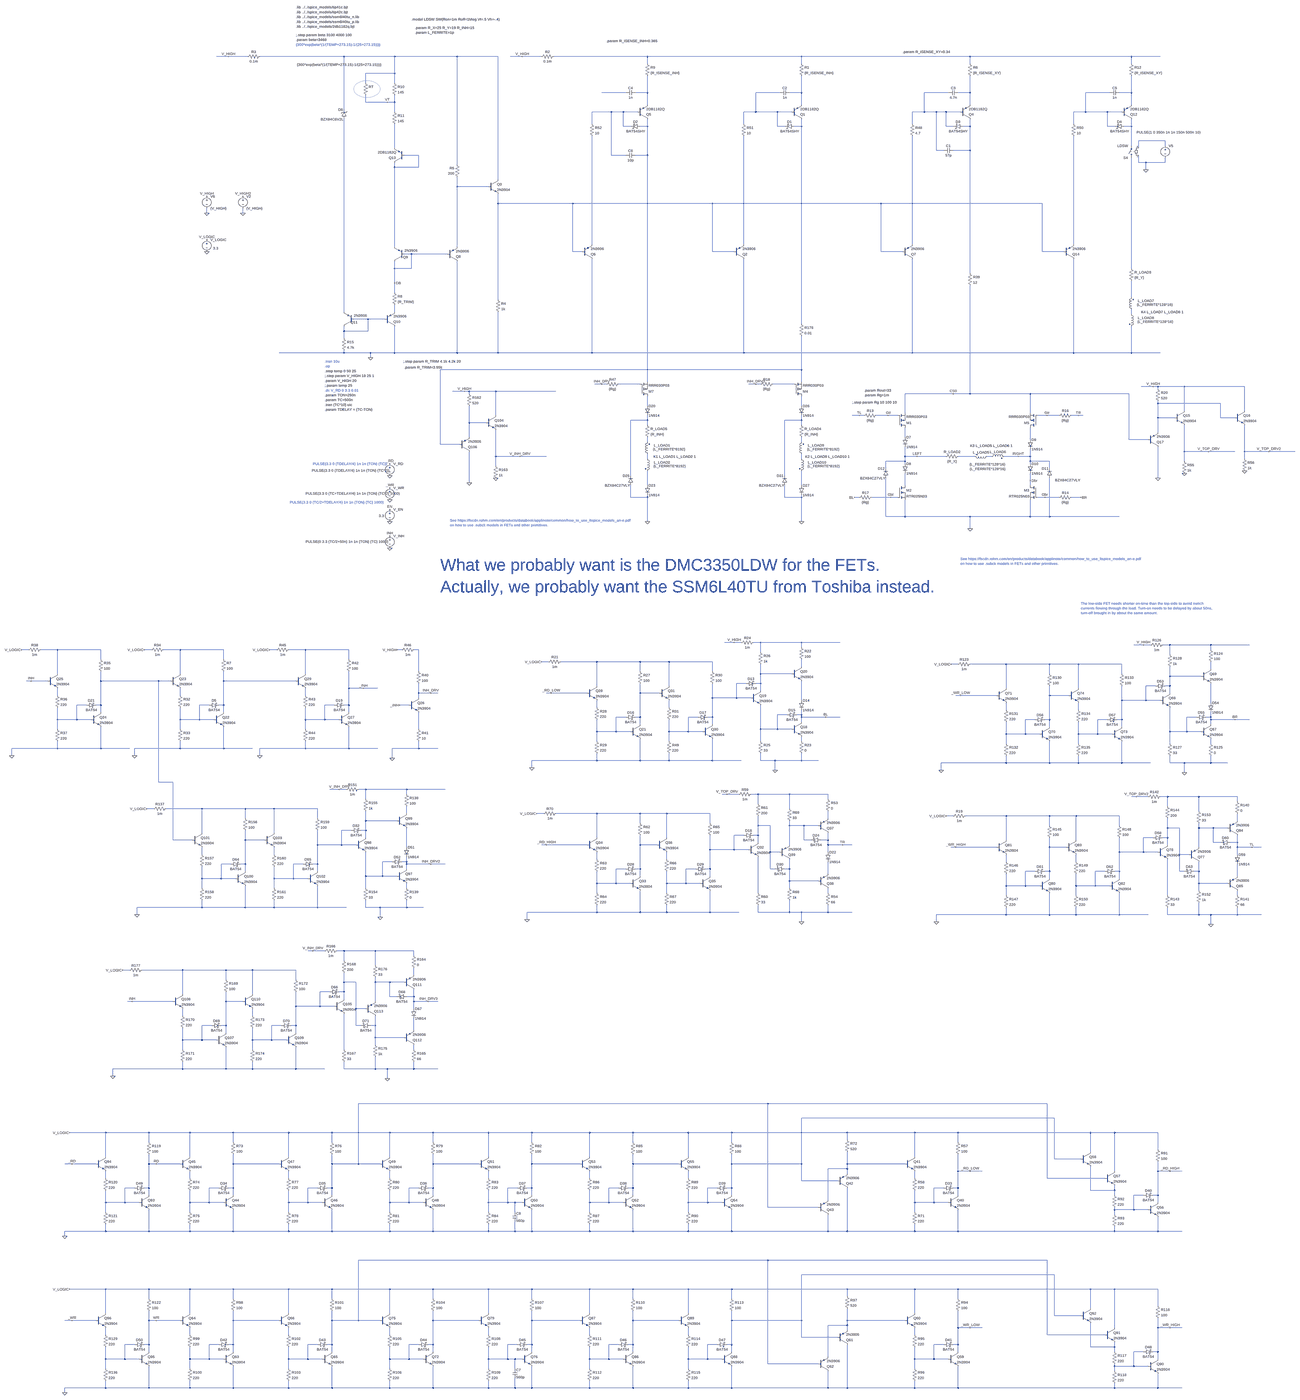
[diagram p0: schematic line_switch_new4.asc, whole sheet]
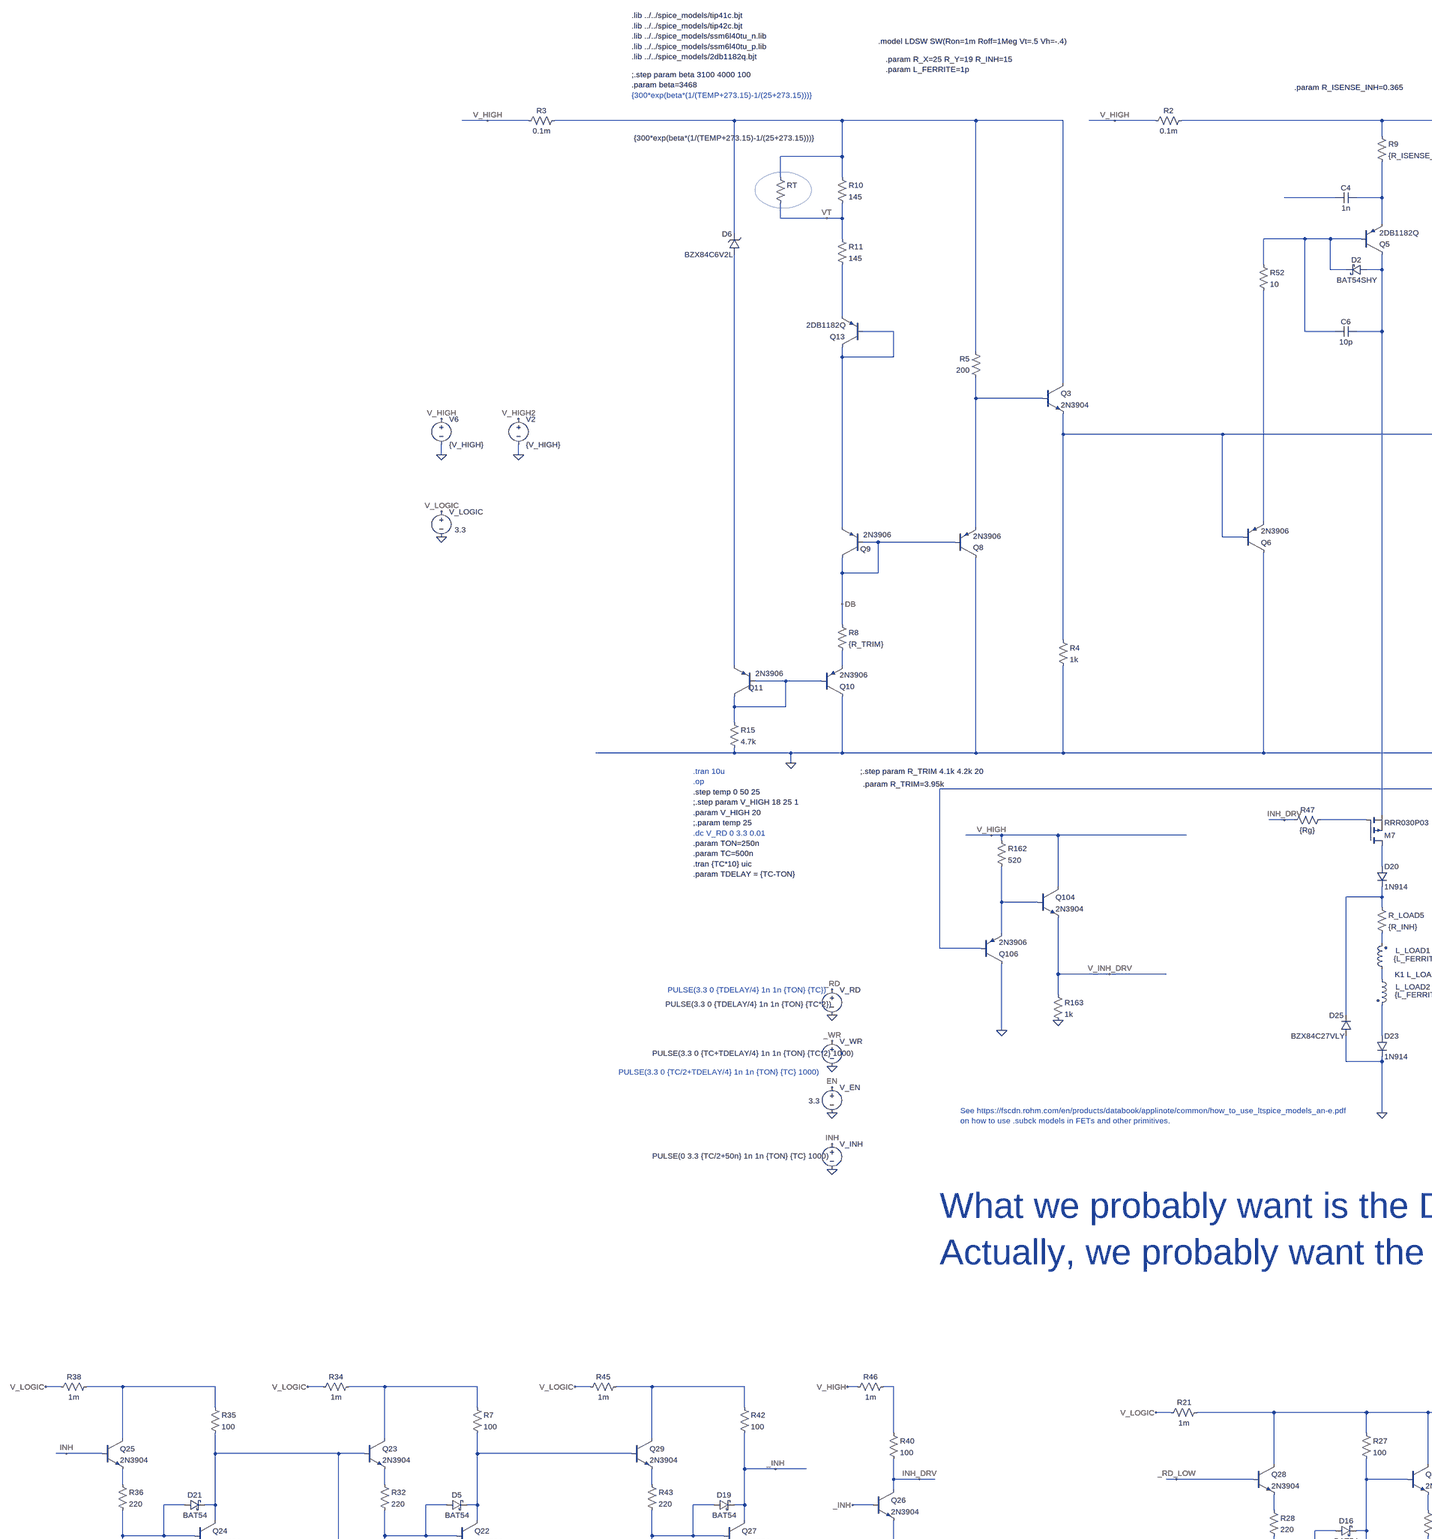
[diagram p1: schematic line_switch_new4.asc, part, row 1 of 2, column 1 of 2]
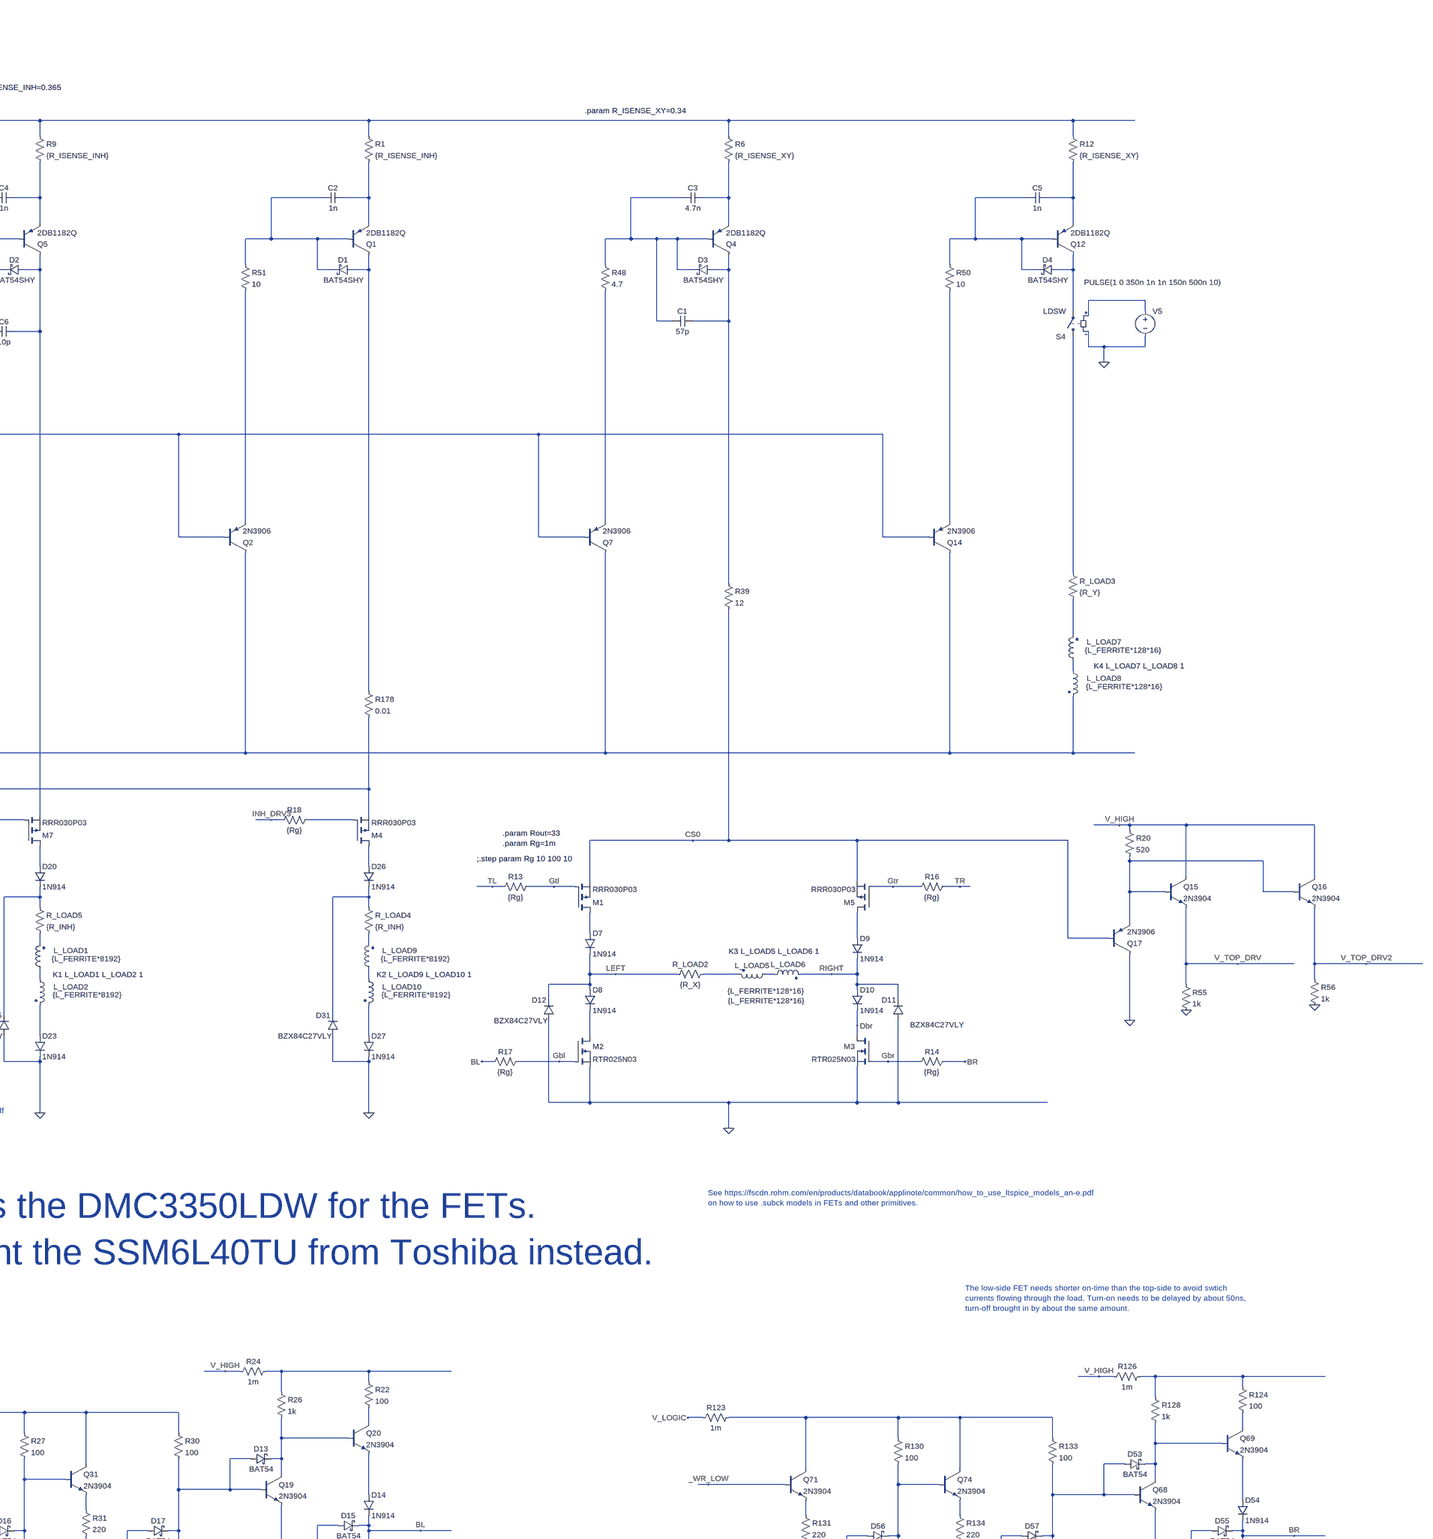
[diagram p2: schematic line_switch_new4.asc, part, row 1 of 2, column 2 of 2]
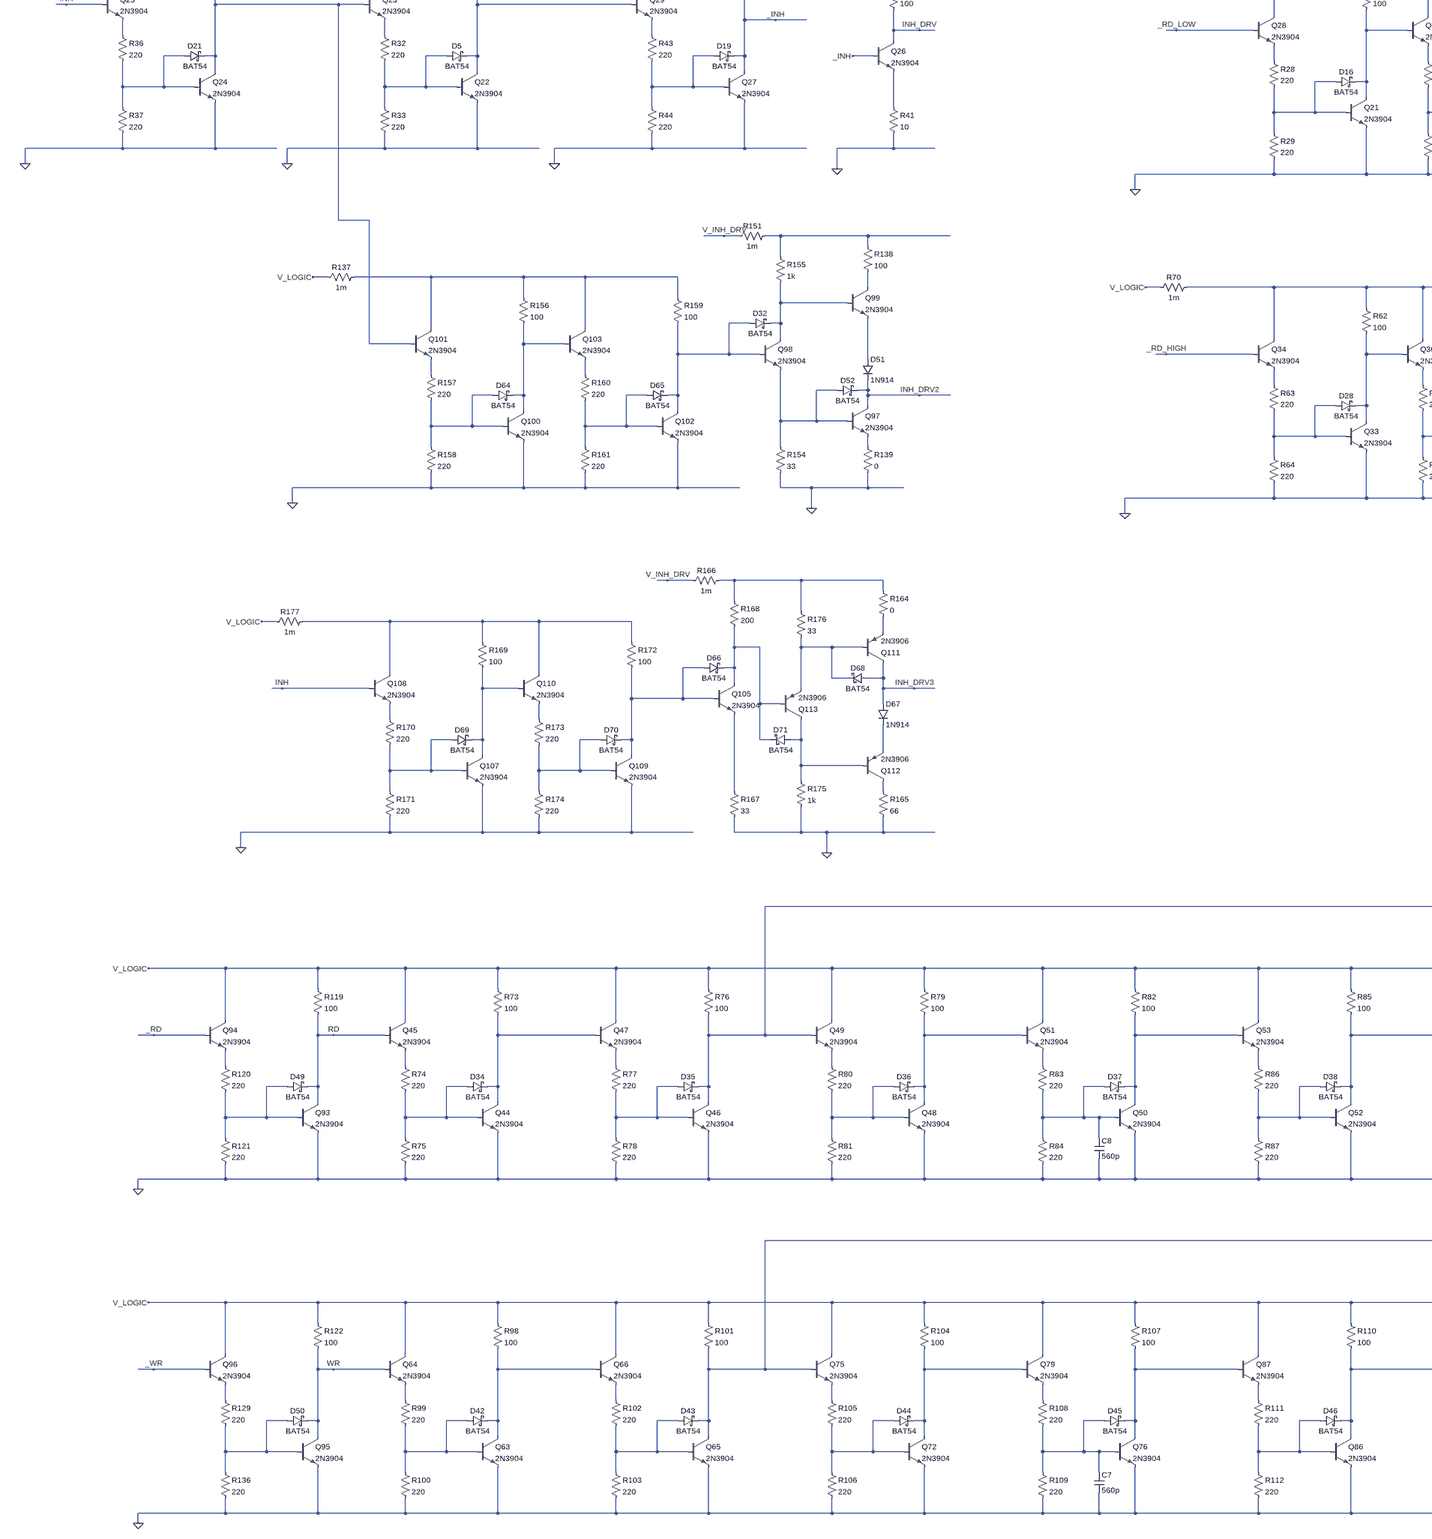
[diagram p3: schematic line_switch_new4.asc, part, row 2 of 2, column 1 of 2]
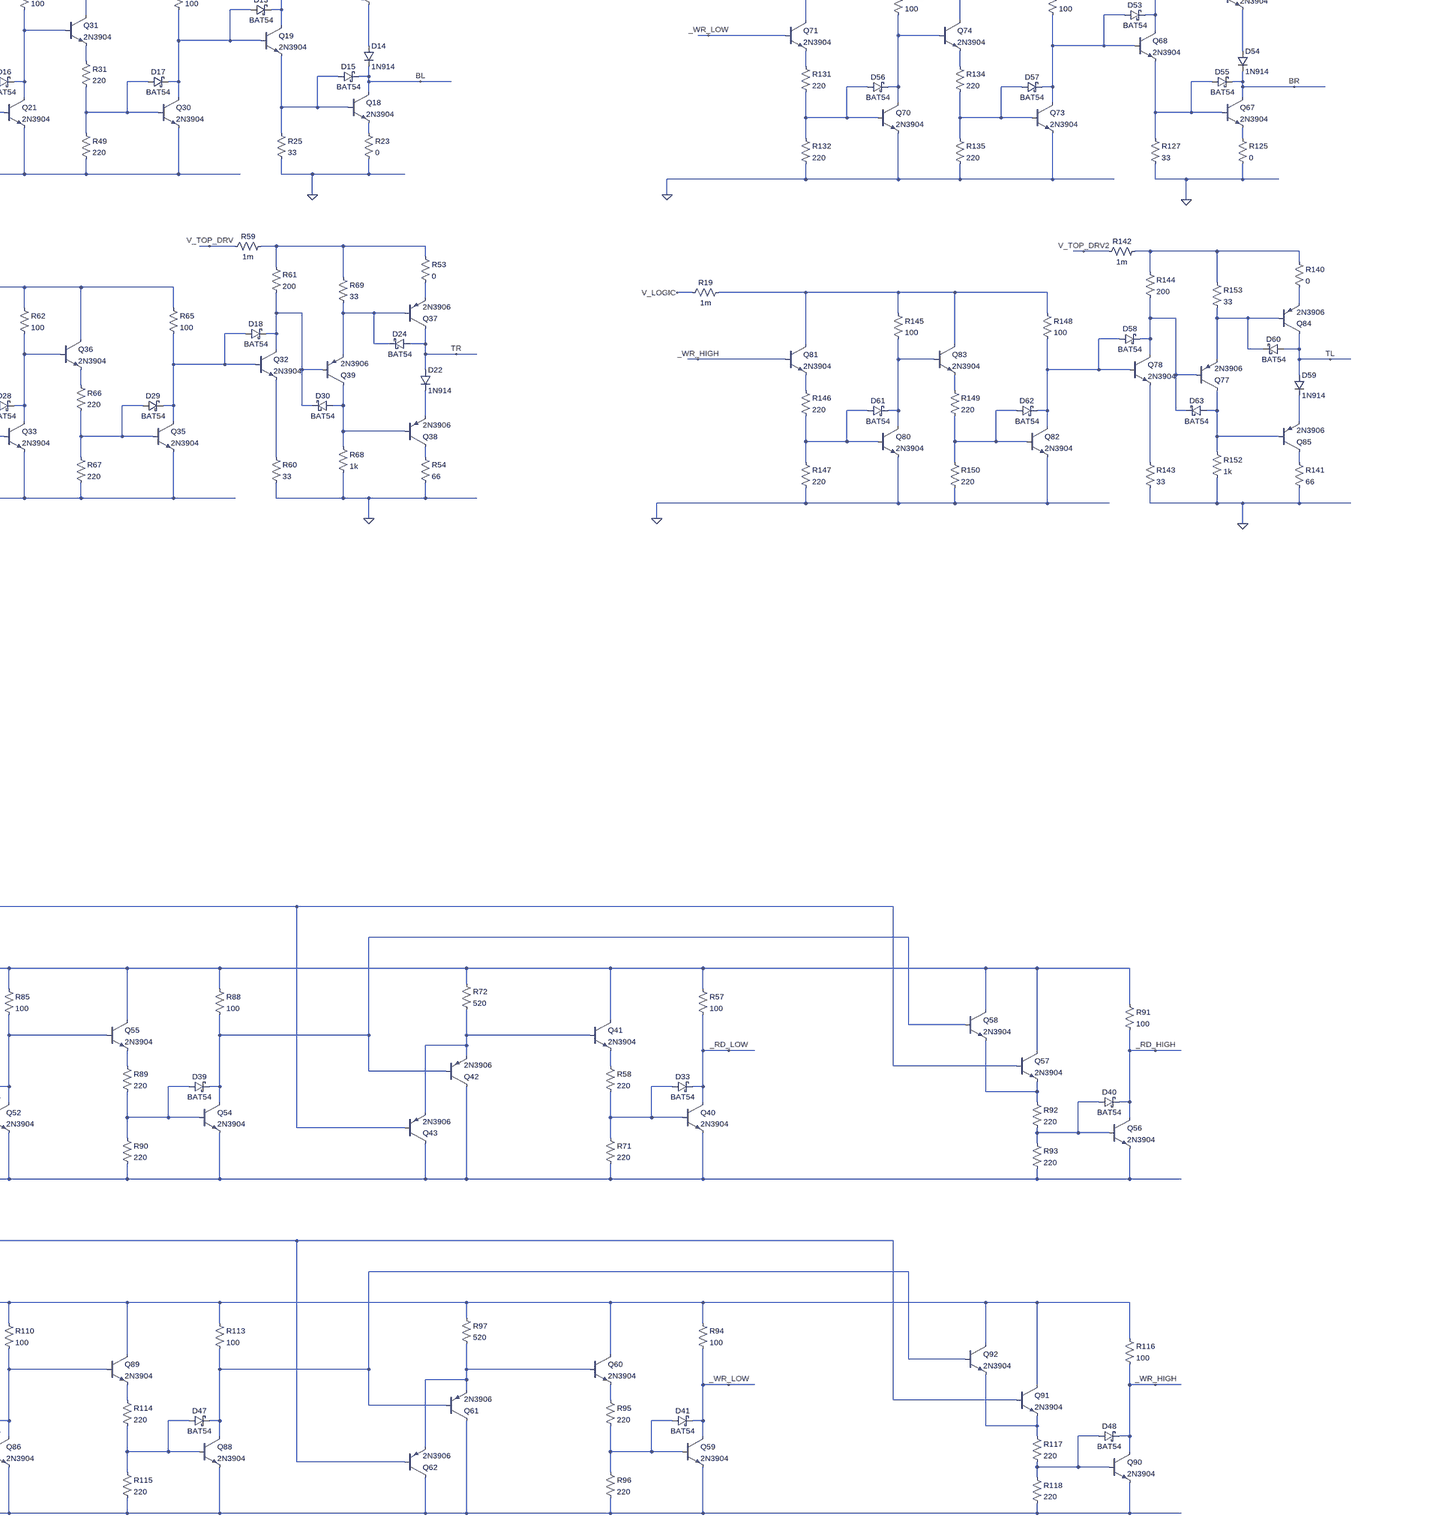
[diagram p4: schematic line_switch_new4.asc, part, row 2 of 2, column 2 of 2]
* line_switch_new4.asc
R8 DB N028 {R_TRIM}
R9 N002 N004 {R_ISENSE_INH}
Q5 N012 N011 N004 0 2DB1182Q
Q8 0 DB N019 0 2N3906
Q9 DB DB N018 0 2N3906
R10 N001 VT 145
R11 VT N017 145
RT N001 VT {300*exp(beta*(1/(TEMP+273.15)-1/(25+273.15)))}
D2 N012 N011 BAT54SHY
D6 N027 N001 BZX84C6V2L
R15 N030 0 4.7k
Q10 0 N030 N028 0 2N3906
Q11 N030 N030 N027 0 2N3906
R1 N002 N006 {R_ISENSE_INH}
Q1 N013 N005 N006 0 2DB1182Q
Q2 0 N020 N022 0 2N3906
D1 N013 N005 BAT54SHY
Q3 N001 N019 N020 0 2N3904
Q6 0 N020 N021 0 2N3906
R4 N020 0 1k
Q13 N018 N018 N017 0 2DB1182Q
R5 N019 N001 200
R6 N002 N008 {R_ISENSE_XY}
Q4 N014 N007 N008 0 2DB1182Q
Q7 0 N020 N023 0 2N3906
D3 N014 N007 BAT54SHY
R_LOAD2 LEFT N044 {R_X}
L_LOAD5 N045 N044 {L_FERRITE*128*16}
L_LOAD6 N045 RIGHT {L_FERRITE*128*16}
R12 N002 N010 {R_ISENSE_XY}
Q12 N015 N009 N010 0 2DB1182Q
Q14 0 N020 N024 0 2N3906
D4 N015 N009 BAT54SHY
S4 N025 N015 N016 0 LDSW
V5 N016 0 PULSE(1 0 350n 1n 1n 150n 500n 10)
R_LOAD3 N025 N026 {R_Y}
L_LOAD7 N029 N026 {L_FERRITE*128*16}
L_LOAD8 N029 0 {L_FERRITE*128*16}
R2 V_HIGH N002 0.1m
R3 V_HIGH N001 0.1m
V6 V_HIGH 0 {V_HIGH}
D7 N040 LEFT 1N914
D8 LEFT N050 1N914
D9 N041 RIGHT 1N914
D10 RIGHT Dbr 1N914
D11 0 RIGHT BZX84C27VLY
D12 0 LEFT BZX84C27VLY
V_RD _RD 0 PULSE(3.3 0 {TDELAY/4} 1n 1n {TON} {TC*2})
V_EN EN 0 3.3
V_LOGIC V_LOGIC 0 3.3
R13 Gtl TL {Rg}
R14 BR Gbr {Rg}
R16 TR Gtr {Rg}
R17 Gbl BL {Rg}
R_LOAD5 N037 N042 {R_INH}
L_LOAD1 N046 N042 {L_FERRITE*8192}
L_LOAD2 N046 N048 {L_FERRITE*8192}
M5 N041 Gtr CS0 CS0 RRR030P03
M1 N040 Gtl CS0 CS0 RRR030P03
M2 N050 Gbl 0 0 RTR025N03
M3 Dbr Gbr 0 0 RTR025N03
V_INH INH 0 PULSE(0 3.3 {TC/2+50n} 1n 1n {TON} {TC} 1000)
Q26 INH_DRV _INH N087 0 2N3904
R40 N056 INH_DRV 100
R41 N087 0 10
Q27 _INH N076 0 0 2N3904
D19 N076 _INH BAT54
Q29 N055 N064 N070 0 2N3904
R42 N055 _INH 100
R43 N070 N076 220
R44 N076 0 220
R45 V_LOGIC N055 1m
R46 V_HIGH N056 1m
D20 N035 N037 1N914
D23 N048 0 1N914
D25 0 N037 BZX84C27VLY
R47 N032 INH_DRV {Rg}
M7 N035 N032 N012 N012 RRR030P03
R48 N007 N023 4.7
C1 N014 N007 57p
C3 N008 N007 4.7n
R50 N009 N024 10
R51 N005 N022 10
R52 N011 N021 10
C2 N006 N005 1n
C4 N004 N003 1n
C5 N010 N009 1n
C6 N012 N011 10p
Q22 N064 N075 0 0 2N3904
D5 N075 N064 BAT54
Q23 N054 N063 N069 0 2N3904
R7 N054 N064 100
R32 N069 N075 220
R33 N075 0 220
R34 V_LOGIC N054 1m
Q24 N063 N074 0 0 2N3904
D21 N074 N063 BAT54
Q25 N053 INH N068 0 2N3904
R35 N053 N063 100
R36 N068 N074 220
R37 N074 0 220
R38 V_LOGIC N053 1m
R39 N014 CS0 12
V2 V_HIGH2 0 {V_HIGH}
R123 V_LOGIC N058 1m
Q67 BR N084 N089 0 2N3904
R124 N052 N060 100
R125 N089 0 0
R126 V_HIGH N052 1m
Q68 N062 N066 N084 0 2N3904
R127 N084 0 33
R128 N052 N062 1k
Q69 N060 N062 N073 0 2N3904
D53 N066 N062 BAT54
D54 N073 BR 1N914
D55 N084 BR BAT54
Q70 N071 N085 0 0 2N3904
D56 N085 N071 BAT54
Q71 N058 _WR_LOW N079 0 2N3904
R130 N058 N071 100
R131 N079 N085 220
R132 N085 0 220
Q73 N066 N086 0 0 2N3904
D57 N086 N066 BAT54
Q74 N058 N071 N080 0 2N3904
R133 N058 N066 100
R134 N080 N086 220
R135 N086 0 220
R140 N092 N099 0
R141 N132 0 66
R142 V_TOP_DRV2 N092 1m
Q78 N102 N106 N131 0 2N3904
R143 N131 0 33
R144 N092 N102 200
D58 N106 N102 BAT54
D59 TL N127 1N914
D60 TL N103 BAT54
Q80 N110 N123 0 0 2N3904
D61 N123 N110 BAT54
Q81 N096 _WR_HIGH N116 0 2N3904
R145 N096 N110 100
R146 N116 N123 220
R147 N123 0 220
Q82 N106 N124 0 0 2N3904
D62 N124 N106 BAT54
Q83 N096 N110 N117 0 2N3904
R148 N096 N106 100
R149 N117 N124 220
R150 N124 0 220
Q84 TL N103 N099 0 2N3906
Q85 N132 N125 N127 0 2N3906
Q77 N125 N102 N103 0 2N3906
R152 N125 0 1k
R153 N092 N103 33
D63 N125 N102 BAT54
R19 V_LOGIC N096 1m
V_WR _WR 0 PULSE(3.3 0 {TC+TDELAY/4} 1n 1n {TON} {TC*2} 1000)
Q15 V_HIGH N034 V_TOP_DRV 0 2N3904
Q16 V_HIGH N034 V_TOP_DRV2 0 2N3904
Q17 0 CS0 N034 0 2N3906
R20 V_HIGH N034 520
R55 V_TOP_DRV 0 1k
R56 V_TOP_DRV2 0 1k
R21 V_LOGIC N057 1m
Q18 BL N081 N088 0 2N3904
R22 N051 N059 100
R23 N088 0 0
R24 V_HIGH N051 1m
Q19 N061 N065 N081 0 2N3904
R25 N081 0 33
R26 N051 N061 1k
Q20 N059 N061 N072 0 2N3904
D13 N065 N061 BAT54
D14 N072 BL 1N914
D15 N081 BL BAT54
Q21 N067 N082 0 0 2N3904
D16 N082 N067 BAT54
Q28 N057 _RD_LOW N077 0 2N3904
R27 N057 N067 100
R28 N077 N082 220
R29 N082 0 220
Q30 N065 N083 0 0 2N3904
D17 N083 N065 BAT54
Q31 N057 N067 N078 0 2N3904
R30 N057 N065 100
R31 N078 N083 220
R49 N083 0 220
R53 N091 N097 0
R54 N130 0 66
R59 V_TOP_DRV N091 1m
Q32 N100 N105 N129 0 2N3904
R60 N129 0 33
R61 N091 N100 200
D18 N105 N100 BAT54
D22 TR N126 1N914
D24 TR N101 BAT54
Q33 N108 N120 0 0 2N3904
D28 N120 N108 BAT54
Q34 N095 _RD_HIGH N113 0 2N3904
R62 N095 N108 100
R63 N113 N120 220
R64 N120 0 220
Q35 N105 N121 0 0 2N3904
D29 N121 N105 BAT54
Q36 N095 N108 N114 0 2N3904
R65 N095 N105 100
R66 N114 N121 220
R67 N121 0 220
Q37 TR N101 N097 0 2N3906
Q38 N130 N122 N126 0 2N3906
Q39 N122 N100 N101 0 2N3906
R68 N122 0 1k
R69 N091 N101 33
D30 N122 N100 BAT54
R70 V_LOGIC N095 1m
Q40 _RD_LOW N170 0 0 2N3904
D33 N170 _RD_LOW BAT54
Q41 V_LOGIC N154 N162 0 2N3904
R57 V_LOGIC _RD_LOW 100
R58 N162 N170 220
R71 N170 0 220
Q42 0 N149 N154 0 2N3906
Q43 0 N148 N154 0 2N3906
R72 V_LOGIC N154 520
Q44 N150 N164 0 0 2N3904
D34 N164 N150 BAT54
Q45 V_LOGIC RD N156 0 2N3904
R73 V_LOGIC N150 100
R74 N156 N164 220
R75 N164 0 220
Q46 N148 N165 0 0 2N3904
D35 N165 N148 BAT54
Q47 V_LOGIC N150 N157 0 2N3904
R76 V_LOGIC N148 100
R77 N157 N165 220
R78 N165 0 220
Q48 N151 N166 0 0 2N3904
D36 N166 N151 BAT54
Q49 V_LOGIC N148 N158 0 2N3904
R79 V_LOGIC N151 100
R80 N158 N166 220
R81 N166 0 220
Q50 N152 N167 0 0 2N3904
D37 N167 N152 BAT54
Q51 V_LOGIC N151 N159 0 2N3904
R82 V_LOGIC N152 100
R83 N159 N167 220
R84 N167 0 220
Q52 N153 N168 0 0 2N3904
D38 N168 N153 BAT54
Q53 V_LOGIC N152 N160 0 2N3904
R85 V_LOGIC N153 100
R86 N160 N168 220
R87 N168 0 220
Q54 N149 N169 0 0 2N3904
D39 N169 N149 BAT54
Q55 V_LOGIC N153 N161 0 2N3904
R88 V_LOGIC N149 100
R89 N161 N169 220
R90 N169 0 220
Q56 _RD_HIGH N172 0 0 2N3904
D40 N172 _RD_HIGH BAT54
Q57 V_LOGIC N148 N171 0 2N3904
R91 V_LOGIC _RD_HIGH 100
R92 N171 N172 220
R93 N172 0 220
Q58 V_LOGIC N149 N171 0 2N3904
Q59 _WR_LOW N195 0 0 2N3904
D41 N195 _WR_LOW BAT54
Q60 V_LOGIC N179 N187 0 2N3904
R94 V_LOGIC _WR_LOW 100
R95 N187 N195 220
R96 N195 0 220
Q61 0 N174 N179 0 2N3906
Q62 0 N173 N179 0 2N3906
R97 V_LOGIC N179 520
Q63 N175 N189 0 0 2N3904
D42 N189 N175 BAT54
Q64 V_LOGIC WR N181 0 2N3904
R98 V_LOGIC N175 100
R99 N181 N189 220
R100 N189 0 220
Q65 N173 N190 0 0 2N3904
D43 N190 N173 BAT54
Q66 V_LOGIC N175 N182 0 2N3904
R101 V_LOGIC N173 100
R102 N182 N190 220
R103 N190 0 220
Q72 N176 N191 0 0 2N3904
D44 N191 N176 BAT54
Q75 V_LOGIC N173 N183 0 2N3904
R104 V_LOGIC N176 100
R105 N183 N191 220
R106 N191 0 220
Q76 N177 N192 0 0 2N3904
D45 N192 N177 BAT54
Q79 V_LOGIC N176 N184 0 2N3904
R107 V_LOGIC N177 100
R108 N184 N192 220
R109 N192 0 220
Q86 N178 N193 0 0 2N3904
D46 N193 N178 BAT54
Q87 V_LOGIC N177 N185 0 2N3904
R110 V_LOGIC N178 100
R111 N185 N193 220
R112 N193 0 220
Q88 N174 N194 0 0 2N3904
D47 N194 N174 BAT54
Q89 V_LOGIC N178 N186 0 2N3904
R113 V_LOGIC N174 100
R114 N186 N194 220
R115 N194 0 220
Q90 _WR_HIGH N197 0 0 2N3904
D48 N197 _WR_HIGH BAT54
Q91 V_LOGIC N173 N196 0 2N3904
R116 V_LOGIC _WR_HIGH 100
R117 N196 N197 220
R118 N197 0 220
Q92 V_LOGIC N174 N196 0 2N3904
Q93 RD N163 0 0 2N3904
D49 N163 RD BAT54
Q94 V_LOGIC _RD N155 0 2N3904
R119 V_LOGIC RD 100
R120 N155 N163 220
R121 N163 0 220
Q95 WR N188 0 0 2N3904
D50 N188 WR BAT54
Q96 V_LOGIC _WR N180 0 2N3904
R122 V_LOGIC WR 100
R129 N180 N188 220
R136 N188 0 220
C7 N192 0 560p
C8 N167 0 560p
R_LOAD4 N038 N043 {R_INH}
L_LOAD9 N047 N043 {L_FERRITE*8192}
L_LOAD10 N047 N049 {L_FERRITE*8192}
D26 N036 N038 1N914
D27 N049 0 1N914
D31 0 N038 BZX84C27VLY
R18 N033 INH_DRV3 {Rg}
M4 N036 N033 N031 N031 RRR030P03
R137 V_LOGIC N093 1m
Q97 INH_DRV2 N115 N128 0 2N3904
R138 N090 N094 100
R139 N128 0 0
R151 V_INH_DRV N090 1m
Q98 N098 N104 N115 0 2N3904
R154 N115 0 33
R155 N090 N098 1k
Q99 N094 N098 N109 0 2N3904
D32 N104 N098 BAT54
D51 N109 INH_DRV2 1N914
D52 N115 INH_DRV2 BAT54
Q100 N107 N118 0 0 2N3904
D64 N118 N107 BAT54
Q101 N093 N063 N111 0 2N3904
R156 N093 N107 100
R157 N111 N118 220
R158 N118 0 220
Q102 N104 N119 0 0 2N3904
D65 N119 N104 BAT54
Q103 N093 N107 N112 0 2N3904
R159 N093 N104 100
R160 N112 N119 220
R161 N119 0 220
Q104 V_HIGH N039 V_INH_DRV 0 2N3904
Q106 0 N031 N039 0 2N3906
R162 V_HIGH N039 520
R163 V_INH_DRV 0 1k
R164 N133 N135 0
R165 N147 0 66
R166 V_INH_DRV N133 1m
Q105 N136 N138 N146 0 2N3904
R167 N146 0 33
R168 N133 N136 200
D66 N138 N136 BAT54
D67 INH_DRV3 N145 1N914
D68 INH_DRV3 N137 BAT54
Q107 N139 N142 0 0 2N3904
D69 N142 N139 BAT54
Q108 N134 INH N140 0 2N3904
R169 N134 N139 100
R170 N140 N142 220
R171 N142 0 220
Q109 N138 N143 0 0 2N3904
D70 N143 N138 BAT54
Q110 N134 N139 N141 0 2N3904
R172 N134 N138 100
R173 N141 N143 220
R174 N143 0 220
Q111 INH_DRV3 N137 N135 0 2N3906
Q112 N147 N144 N145 0 2N3906
Q113 N144 N136 N137 0 2N3906
R175 N144 0 1k
R176 N133 N137 33
D71 N144 N136 BAT54
R177 V_LOGIC N134 1m
R178 N013 N031 0.01
.model D D
.lib standard.dio
.model NPN NPN
.model PNP PNP
.lib standard.bjt
.model NMOS NMOS
.model PMOS PMOS
.lib standard.mos
.lib ../../spice_models/tip42c.bjt
.lib ../../spice_models/tip41c.bjt
.step temp 0 50 25
* .op
;.step param V_HIGH 18 25 1
.param beta=3468
;.step param beta 3100 4000 100
* {300*exp(beta*(1/(TEMP+273.15)-1/(25+273.15)))}
.param L_FERRITE=1p
.param R_X=25 R_Y=19 R_INH=15
.param R_ISENSE_INH=0.365
;.step param R_TRIM 4.1k 4.2k 20
.param R_TRIM=3.95k
.param V_HIGH 20
;.param temp 25
.model LDSW SW(Ron=1m Roff=1Meg Vt=.5 Vh=-.4)
* .tran 10u
K3 L_LOAD5 L_LOAD6 1
K4 L_LOAD7 L_LOAD8 1
.param R_ISENSE_XY=0.34
.tran {TC*10} uic
.param TON=250n
.param TC=500n
.param Rg=1m
;.step param Rg 10 100 10
* .dc V_RD 0 3.3 0.01
.param Rout=33
* PULSE(3.3 0 {TDELAY/4} 1n 1n {TON} {TC})
* What we probably want is the DMC3350LDW for the FETs.
* Actually, we probably want the SSM6L40TU from Toshiba instead.
.lib ../../spice_models/ssm6l40tu_n.lib
.lib ../../spice_models/ssm6l40tu_p.lib
* See https://fscdn.rohm.com/en/products/databook/applinote/common/how_to_use_ltspice_models_an-e.pdf
* on how to use .subck models in FETs and other primitives.
K1 L_LOAD1 L_LOAD2 1
* See https://fscdn.rohm.com/en/products/databook/applinote/common/how_to_use_ltspice_models_an-e.pdf
* on how to use .subck models in FETs and other primitives.
.param TDELAY = {TC-TON}
.lib ../../spice_models/2db1182q.bjt
* PULSE(3.3 0 {TC/2+TDELAY/4} 1n 1n {TON} {TC} 1000)
* The low-side FET needs shorter on-time than the top-side to avoid swtich
* currents flowing through the load. Turn-on needs to be delayed by about 50ns,
* turn-off brought in by about the same amount.
K2 L_LOAD9 L_LOAD10 1
.backanno
.end